# EAGLE design CANMOD-v1_0 (EAGLE 9.7.0)
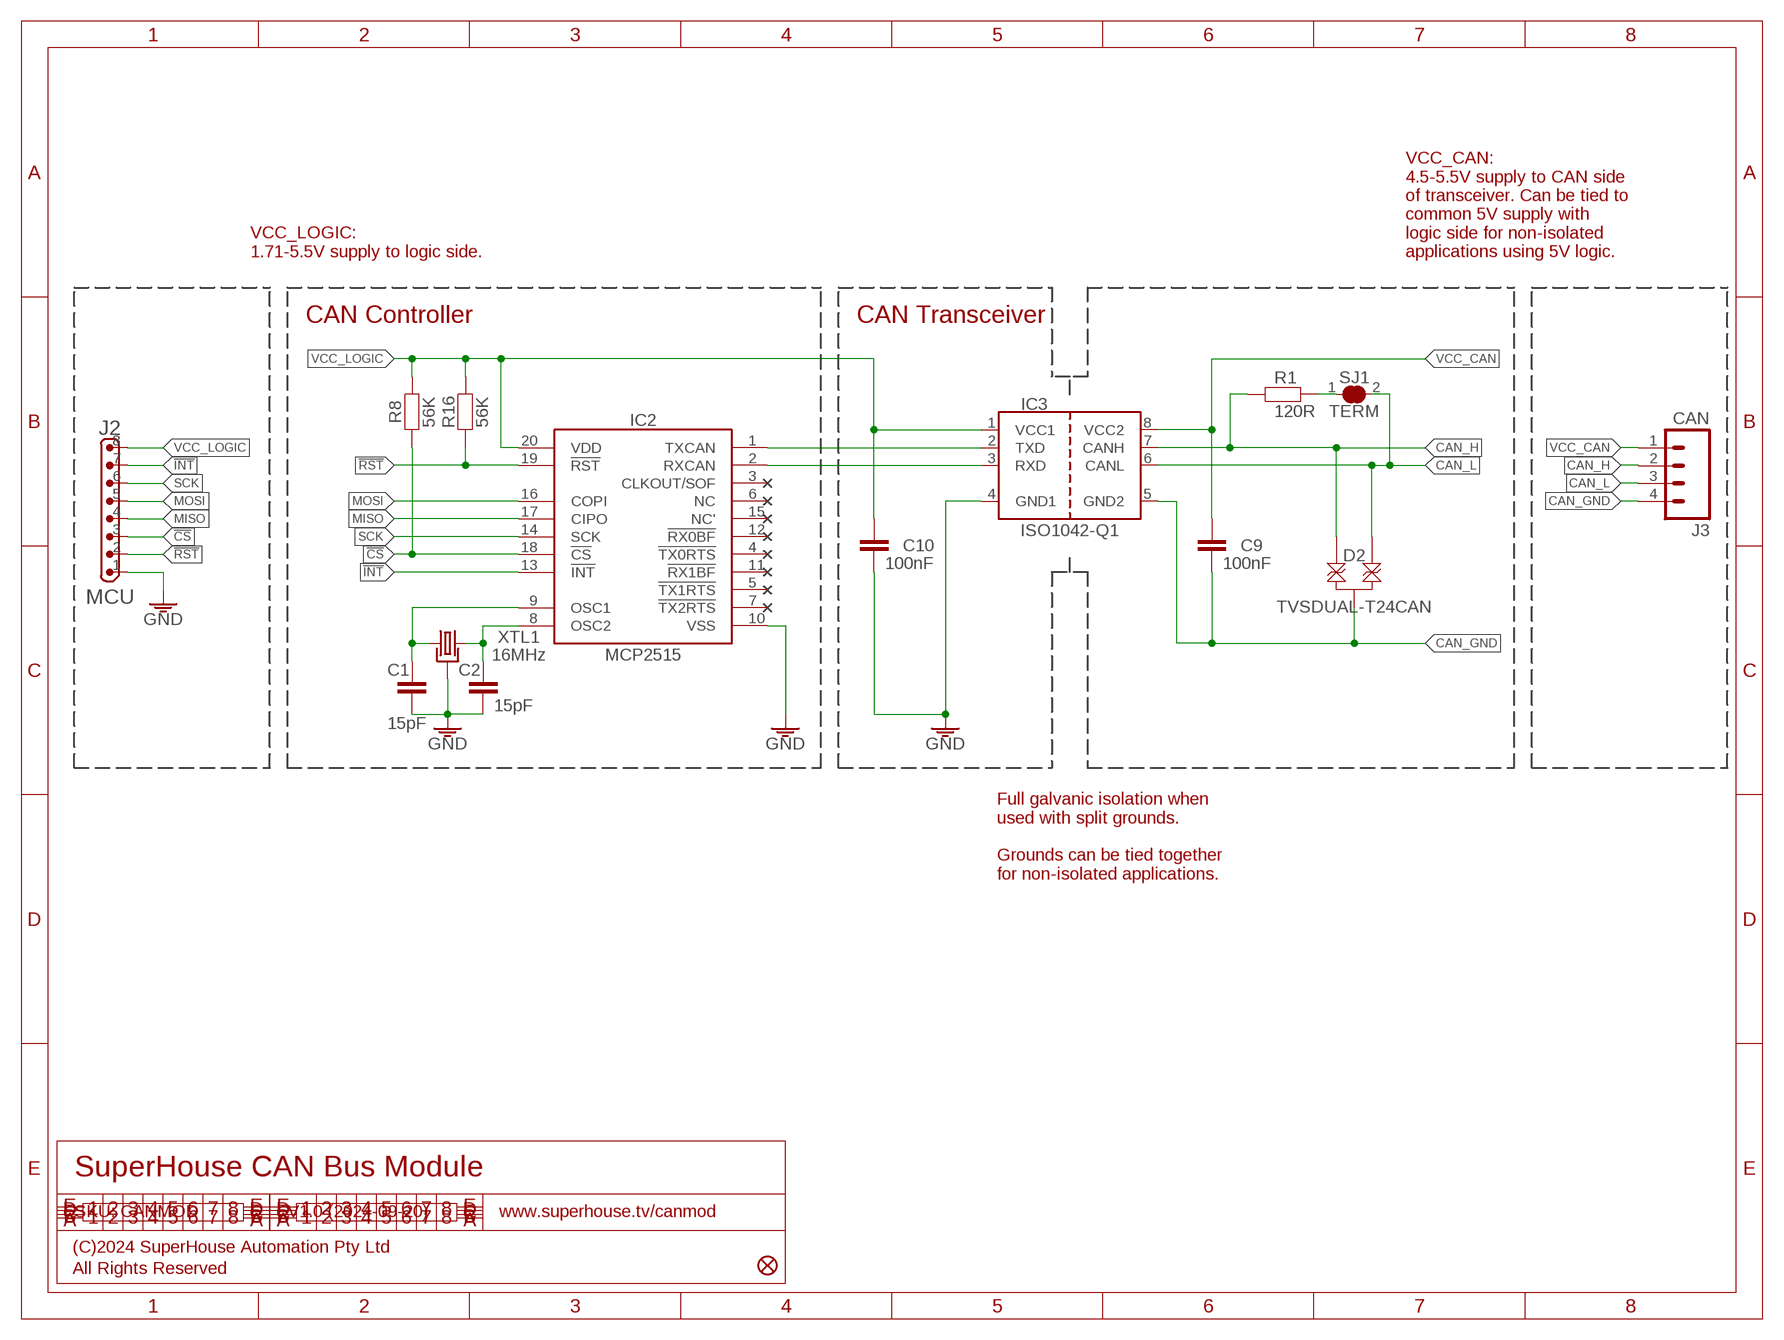
[diagram p0: schematic, sheet 1]

## Parts
C1  15pF  CAP0603  [C0603]
C2  15pF  CAP0603  [C0603]
C9  100nF  CAP0603  [C0603]
C10  100nF  CAP0603  [C0603]
D2  TVSDUAL-T24CAN  [SOT23-3]
FID1  FIDUCIAL1X2.5  [FIDUCIAL-1X2.5]
IC2  SN65HVD231DR  MCP2515  [TSSOP20]
IC3  ISO1042-Q1  [SO08-W]
J2  MCU  M08-PLAIN  [1X08]
J3  CAN  M04-PLAIN  [1X04]
R1  120R  RESISTOR2010  [R2010]
R8  56K  RESISTOR0603  [R0603]
R16  56K  RESISTOR0603  [R0603]
SJ1  TERM  SJC-NORMAL  [SJC]
XTL1  16MHz  CRYSTAL-GND3X2  [CRYSTAL-SMD-3X2]

## Nets
!CS: IC2.18(!CS) J2.3 R8.1
!INT: IC2.13(!INT) J2.7
!RST: IC2.19(!RST) J2.2 R16.1
CAN_GND: C9.2 D2.3 IC3.5(GND2) J3.4
CAN_H: D2.2 IC3.7(CANH) J3.2 R1.1
CAN_L: D2.1 IC3.6(CANL) J3.3 SJ1.2
GND: C1.2 C2.2 C10.2 IC2.10(VSS) IC3.4(GND1) J2.1 XTL1.2(GND) XTL1.4(GND)
MISO: IC2.17(CIPO) J2.4
MOSI: IC2.16(COPI) J2.5
N$1: R1.2 SJ1.1
N$13: IC2.1(TXCAN) IC3.2(TXD)
N$17: IC2.2(RXCAN) IC3.3(RXD)
N$21: C2.1 IC2.8(OSC2) XTL1.3
N$22: C1.1 IC2.9(OSC1) XTL1.1
SCK: IC2.14(SCK) J2.6
VCC_CAN: C9.1 IC3.8(VCC2) J3.1
VCC_LOGIC: C10.1 IC2.20(VDD) IC3.1(VCC1) J2.8 R8.2 R16.2
Unconnected: IC2.3(CLKOUT/SOF) IC2.4(!TX0RTS) IC2.5(!TX1RTS) IC2.6(NC) IC2.7(!TX2RTS) IC2.11(!RX1BF) IC2.12(!RX0BF) IC2.15(NC')

## Notes on the sheet
- VCC_LOGIC:
  1.71-5.5V supply to logic side.
- VCC_CAN:
  4.5-5.5V supply to CAN side
  of transceiver. Can be tied to
  common 5V supply with
  logic side for non-isolated
  applications using 5V logic.
- CAN Controller | CAN Transceiver
- Full galvanic isolation when
  used with split grounds.
  
  Grounds can be tied together
  for non-isolated applications.
- SuperHouse CAN Bus Module
- SKU: CANMOD | V1.0 (2024-09-20) | www.superhouse.tv/canmod
- (C)2024 SuperHouse Automation Pty Ltd
- All Rights Reserved

## Library data of the parts
C1 C2 C9 C10 = SuperHouse-Capacitors:CAP: Capacitor Standard ceramic capacitor
D2 = SuperHouse-Diodes:TVSDUAL: Transient Voltage Suppressor (dual)
FID1 = SuperHouse-Symbols:FIDUCIAL: Fiducial Alignment Points Various fiducial points for machine vision alignment.
IC2 = SuperHouse-ICs:MCP2515: Microchip Technology’s MCP2515 is a stand-alone Controller Area Network (CAN) controller that implements the CAN specification, version 2.0B. It is capable of transmitting and receiving both standard and extended data and remote frames. The MCP2515 has two acceptance masks and six acceptance filters that are used to filter out unwanted messages, thereby reducing the host MCUs overhead. The MCP2515 interfaces with microcontrollers (MCUs) via an industry standard Serial Peripheral Interface (SPI).
IC3 = SuperHouse-ICs:ISO1042-Q1
J2 = SuperHouse-Connectors:M08: 8-way header Standard 1x8 header, and screw terminal variations
J3 = SuperHouse-Connectors:M04: 4-way header Standard 1x4 header, and screw terminal variations
R1 R8 R16 = SuperHouse-Resistors:RESISTOR: Resistors in both surface-mount and through-hole versions.
SJ1 = SuperHouse-Jumpers:SJC: Solder jumper. Normally closed: does not need solder to close. Can be opened by cutting the track.
XTL1 = SuperHouse-Oscillators:CRYSTAL-GND: 3x2mm SMT crystal

## Net classes
0 Default: width 0.203 mm
1 VCC: width 0.305 mm

## Board
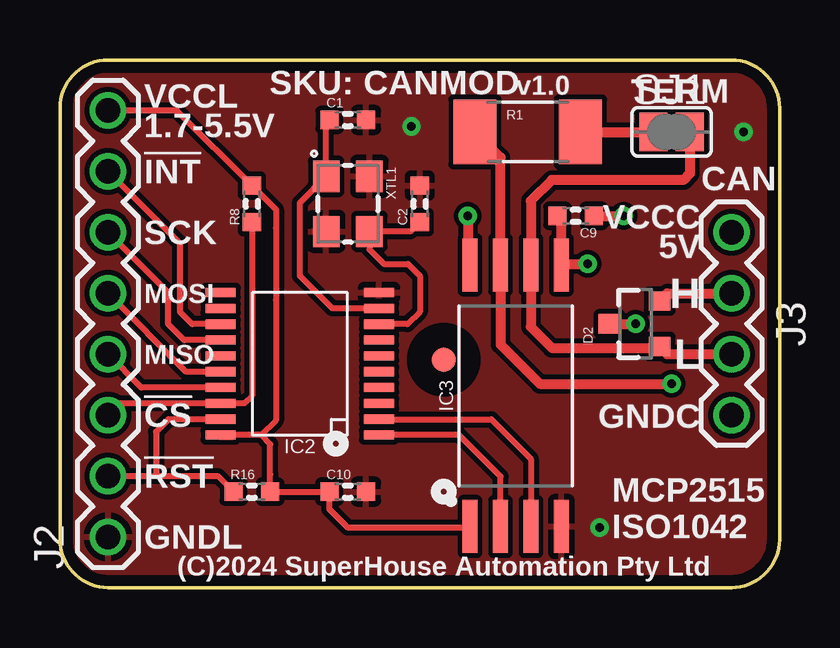
[diagram p1: board, top side]
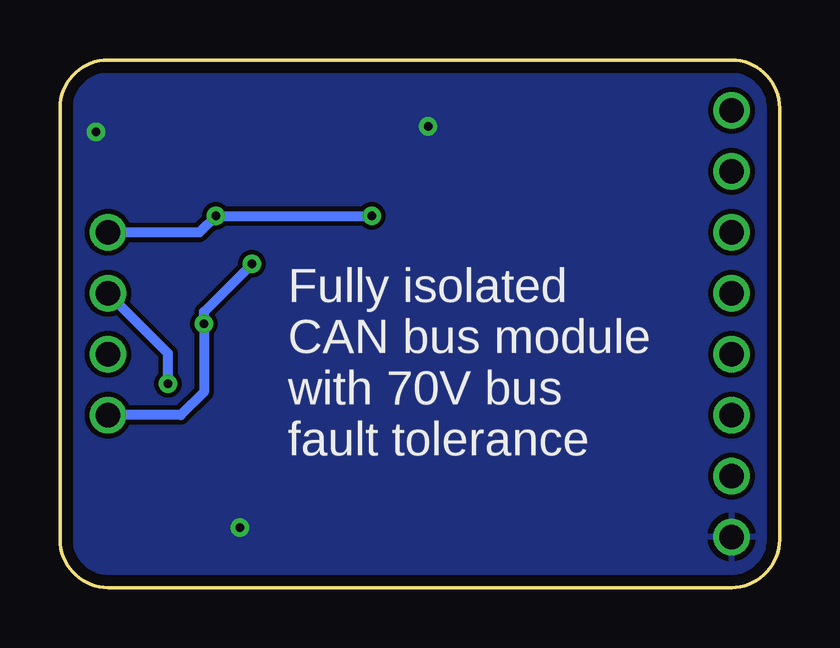
[diagram p2: board, bottom side, seen from below]

Size 30 x 22 mm. Coordinates in mm from the lower left corner, seen from the top.
Outline: 2,22 28,22 arc-90 30,20 30,2 arc-90 28,0 2,0 arc-90 0,2 0,20 arc-90 2,22
Copper layers (1*16): Top 0.035mm / dielectric 1.5mm / Bottom 0.035mm
Design rules "SuperHouse-Design-Rules *": minimum track width 10mil, minimum drill 24mil, track to track 8mil, track to pad 8mil, pad to pad 8mil, via to via 8mil, smd to smd 6mil, copper to edge 18mil, drill to drill 8mil, minimum pad ring 7mil, minimum via ring 8mil, stop-mask expansion 4mil, vias tented up to drill 0.5mm, thermal gap 10mil
tRestrict: area 15,8.5 to 17,10.5

### Footprints (pad centres in the part's own frame; a part is rotated, then mirrored left to right if it is on the bottom)
C0603 = smd 0.762 x 0.762: 1 -0.762,0; 2 0.762,0
SOT23-3 = smd 0.8 x 0.9: 1 -0.95,-1; 2 0.95,-1; 3 0,1.1
FIDUCIAL-1X2.5 = smd 1 x 1: 1 0,0
TSSOP20 = smd 1.27 x 0.381: 1 -3.302,2.642; 2 -3.302,1.981; 3 -3.302,1.321; 4 -3.302,0.66; 5 -3.302,0; 6 -3.302,-0.66; 7 -3.302,-1.321; 8 -3.302,-1.981; 9 -3.302,-2.642; 10 -3.302,-3.302; 11 3.302,-3.302; 12 3.302,-2.642; 13 3.302,-1.981; 14 3.302,-1.321; 15 3.302,-0.66; 16 3.302,0; 17 3.302,0.66; 18 3.302,1.321; 19 3.302,1.981; 20 3.302,2.642
SO08-W = smd 2.21 x 0.61: 1 -5.45,1.905; 2 -5.45,0.635; 3 -5.45,-0.635; 4 -5.45,-1.905; 5 5.45,-1.905; 6 5.45,-0.635; 7 5.45,0.635; 8 5.45,1.905
1X08 = drill 1.016: 1 -8.89,0; 2 -6.35,0; 3 -3.81,0; 4 -1.27,0; 5 1.27,0; 6 3.81,0; 7 6.35,0; 8 8.89,0
1X04 = drill 1.016: 1 -3.81,0; 2 -1.27,0; 3 1.27,0; 4 3.81,0
R2010 = smd 1.8 x 2.7: 1 -2.2,0; 2 2.2,0
R0603 = smd 0.762 x 0.762: 1 -0.762,0; 2 0.762,0
SJC = smd 1.168 x 1.6: 1 -0.762,0; 2 0.762,0
CRYSTAL-SMD-3X2 = smd 1.3 x 1.1: 1 -1.15,-0.9; 2 1.15,-0.9; 3 1.15,0.9; 4 -1.15,0.9

### Placement (x,y rotation side)
C1  12,19.5 0 top
C2  15,16 90 top
C9  21.5,15.5 180 top
C10  12,4 0 top
D2  24,11 90 top
FID1  16,9.5 90 top
IC2  10,9 180 top
IC3  19,8 90 top
J2  2,11 90 top
J3  28,11 270 top
R1  19.5,19 0 top
R8  8,16 90 top
R16  8,4 0 top
SJ1  25.5,19 0 top
XTL1  12,16 270 top

### Tracks (layer width: path | path; a pad name or v marks a point on that pad's centre or on a via)
!CS
  Top 0.254: J2.3 2.49,7.68 IC2.18 7.68,7.68 8,8 R8.1
!INT
  Top 0.254: IC2.13 5.52,10.98 5,11.5 5,12.5 5,14.35 J2.7
!RST
  Top 0.254: J2.2 4,4.65 | 4,4.65 6.59,4.65 R16.1 | IC2.19 4.52,7.02 4.5,7 4,6.5 4,4.65
CAN_GND  (via drill 0.35)
  Top 0.406: v22,13.5 20.95,13.5 IC3.5 20.91,15.33 C9.2 | D2.3 v24,11
  Bottom 0.406: v22,13.5 24,11.5 v24,11 24,8.15 24.96,7.19 J3.4
CAN_H  (via drill 0.35)
  Top 0.406: R1.1 18.36,17.93 IC3.7 18.36,10.13 19,9.5 20,8.5 v25.5,8.5 | D2.2 25.32,12.27 J3.2
  Bottom 0.406: v25.5,8.5 25.5,9.77 J3.2
CAN_L
  Top 0.406: J3.3 25.32,9.73 D2.1 24.95,10 20.5,10 19.64,10.87 IC3.6 19.64,16.14 20.5,17 26,17 26.26,17.26 SJ1.2
GND  (via drill 0.35)
  other vias: 22.5,2.5 14.65,19.23 28.5,19
  pour Top (rank 2): 0.04,0.04 29.96,0.04 29.96,21.96 0.04,21.96
  pour Bottom: 0.04,0.04 29.96,0.04 29.96,21.96 0.04,21.96
MISO
  Top 0.254: IC2.17 3.39,8.34 J2.4
MOSI
  Top 0.254: IC2.16 5.27,9 J2.5
N$1
  Top 0.406: R1.2 SJ1.1
N$13
  Top 0.254: IC3.2 18.36,4.63 18,5 16.64,6.36 IC2.1
N$17
  Top 0.254: IC2.2 17.98,7.02 19,6 19.64,5.37 IC3.3
N$21
  Top 0.254: C2.1 14.61,14.85 XTL1.3 12.9,14.1 13.5,13.5 14.5,13.5 15,13 15,11.5 14.48,10.98 IC2.8
N$22
  Top 0.254: C1.1 11.1,19.36 XTL1.1 10,16.05 10,14.5 10,13 11.36,11.64 IC2.9
SCK
  Top 0.254: IC2.14 5.18,10.32 4.5,11 4.5,12 4.5,12.31 J2.6
VCC_CAN  (via drill 0.35)
  Top 0.406: v17,15.5 17,13.54 IC3.8 | C9.1 v23.5,15.5
  Bottom 0.406: v17,15.5 v23.5,15.5 24.19,14.81 J3.1
VCC_LOGIC
  Top 0.254: 17.05,2.5 13.24,2.5 12.5,2.5 12,2.5 11.24,3.26 C10.1 R16.2 8.76,4.74 8.76,5.98 8.38,6.36 | J2.8 4.87,19.89 R8.2 9,15.76 9,15 9,12 9,6.98 8.38,6.36 | 8.38,6.36 IC2.20
  Top 0.406: IC2.20 7.14,6.36 | IC3.1 17.05,2.5

### Text on the board
tPlace: SKU: CANMOD | v1.0 | VCCL / 1.7-5.5V | TERM | !INT | CAN | SCK | VCCC / 5V | MOSI | H | MISO | L | !CS | GNDC | !RST | MCP2515 / ISO1042 | GNDL | (C)2024 SuperHouse Automation Pty Ltd
bPlace: Fully isolated / CAN bus module / with 70V bus / fault tolerance